# Altium project hardware-h3.PrjPcb
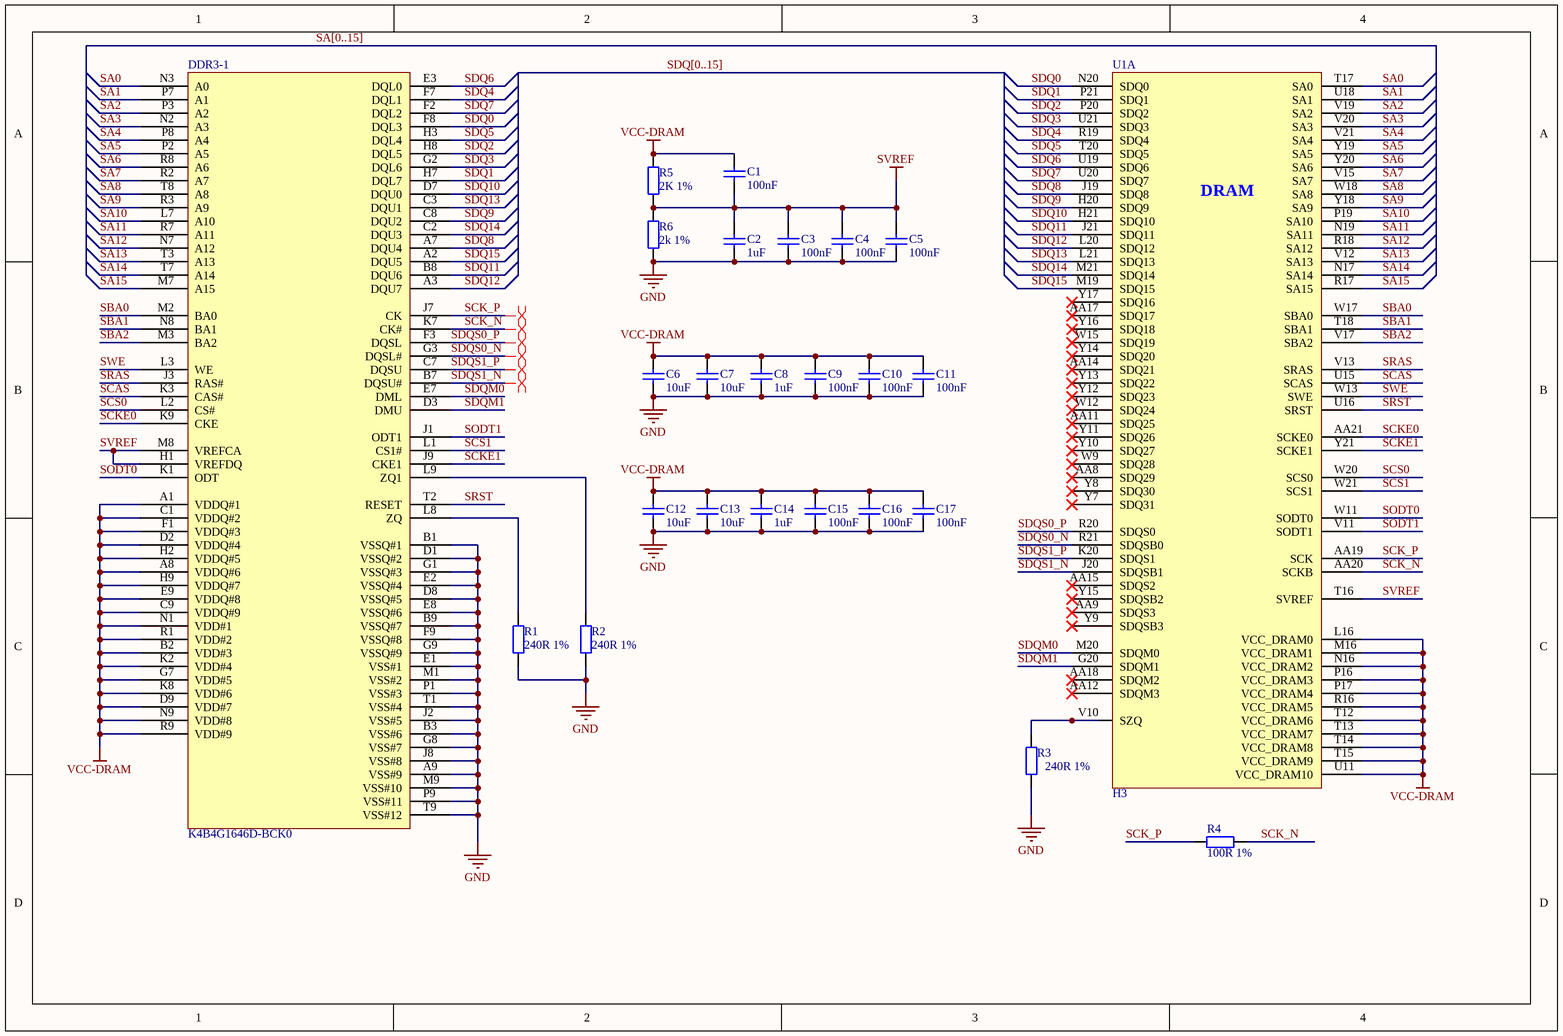
[diagram p0: ddr3.SchDoc]
9 sheets, 135 parts. Net scope: global (net labels, ports and power ports of the same name join across sheets).
Board file: gaga.PcbDoc
Sheets:
  gaga.SchDoc
  ddr3.SchDoc
  emmc.SchDoc
  gpiog-l.SchDoc
  io.SchDoc
  PHY-AUDIO-HDMI-TVout.SchDoc
  power.SchDoc
  screw.SchDoc
  usb-sys.SchDoc

## Sheet gaga.SchDoc
size A; SheetNumber: 1; SheetTotal: 1

## Sheet ddr3.SchDoc
size A4; SheetNumber: 1; SheetTotal: 7

### Parts
C1  100nF  [0402_C]
C2  1uF  [0402_C]
C3  100nF  [0402_C]
C4  100nF  [0402_C]
C5  100nF  [0402_C]
C6  10uF  [0402_C]
C7  10uF  [0402_C]
C8  1uF  [0402_C]
C9  100nF  [0402_C]
C10  100nF  [0402_C]
C11  100nF  [0402_C]
C12  10uF  [0402_C]
C13  10uF  [0402_C]
C14  1uF  [0402_C]
C15  100nF  [0402_C]
C16  100nF  [0402_C]
C17  100nF  [0402_C]
DDR3-1  K4B4G1646D-BCK0  [BGA96_DDR3]
R1  240R 1%  [0402_R]
R2  240R 1%  [0402_R]
R3  240R 1%  [0402_R]
R4  100R 1%  [0402_R]
R5  2K 1%  [0402_R]
R6  2k 1%  [0402_R]
U1  H3  [allwinner-h3]  (part A of 9)

### Nets
GND: C2.2 C3.2 C4.2 C5.2 C6.2 C7.2 C8.2 C9.2 C10.2 C11.2 C12.2 C13.2 C14.2 C15.2 C16.2 C17.2 DDR3-1.A9(VSS#9) DDR3-1.B1(VSSQ#1) DDR3-1.B3(VSS#6) DDR3-1.B9(VSSQ#7) DDR3-1.D1(VSSQ#2) DDR3-1.D8(VSSQ#5) DDR3-1.E1(VSS#1) DDR3-1.E2(VSSQ#4) DDR3-1.E8(VSSQ#6) DDR3-1.F9(VSSQ#8) DDR3-1.G1(VSSQ#3) DDR3-1.G8(VSS#7) DDR3-1.G9(VSSQ#9) DDR3-1.J2(VSS#5) DDR3-1.J8(VSS#8) DDR3-1.M1(VSS#2) DDR3-1.M9(VSS#10) DDR3-1.P1(VSS#3) DDR3-1.P9(VSS#11) DDR3-1.T1(VSS#4) DDR3-1.T9(VSS#12) R1.1 R2.1 R3.1 R6.2
SVREF: C1.2 C2.1 C3.1 C4.1 C5.1 DDR3-1.H1(VREFDQ) DDR3-1.M8(VREFCA) R5.1 R6.1 U1.T16(SVREF)
VCC-DRAM: C1.1 C6.1 C7.1 C8.1 C9.1 C10.1 C11.1 C12.1 C13.1 C14.1 C15.1 C16.1 C17.1 DDR3-1.A1(VDDQ#1) DDR3-1.A8(VDDQ#6) DDR3-1.B2(VDD#3) DDR3-1.C1(VDDQ#2) DDR3-1.C9(VDDQ#9) DDR3-1.D2(VDDQ#4) DDR3-1.D9(VDD#7) DDR3-1.E9(VDDQ#8) DDR3-1.F1(VDDQ#3) DDR3-1.G7(VDD#5) DDR3-1.H2(VDDQ#5) DDR3-1.H9(VDDQ#7) DDR3-1.K2(VDD#4) DDR3-1.K8(VDD#6) DDR3-1.N1(VDD#1) DDR3-1.N9(VDD#8) DDR3-1.R1(VDD#2) DDR3-1.R9(VDD#9) R5.2 U1.L16(VCC_DRAM0) U1.M16(VCC_DRAM1) U1.N16(VCC_DRAM2) U1.P16(VCC_DRAM3) U1.P17(VCC_DRAM4) U1.R16(VCC_DRAM5) U1.T12(VCC_DRAM6) U1.T13(VCC_DRAM7) U1.T14(VCC_DRAM8) U1.T15(VCC_DRAM9) U1.U11(VCC_DRAM10)
SA0: DDR3-1.N3(A0) U1.T17(SA0)
SA1: DDR3-1.P7(A1) U1.U18(SA1)
SA2: DDR3-1.P3(A2) U1.V19(SA2)
SA3: DDR3-1.N2(A3) U1.V20(SA3)
SA4: DDR3-1.P8(A4) U1.V21(SA4)
SA5: DDR3-1.P2(A5) U1.Y19(SA5)
SA6: DDR3-1.R8(A6) U1.Y20(SA6)
SA7: DDR3-1.R2(A7) U1.V15(SA7)
SA8: DDR3-1.T8(A8) U1.W18(SA8)
SA9: DDR3-1.R3(A9) U1.Y18(SA9)
SA10: DDR3-1.L7(A10) U1.P19(SA10)
SA11: DDR3-1.R7(A11) U1.N19(SA11)
SA12: DDR3-1.N7(A12) U1.R18(SA12)
SA13: DDR3-1.T3(A13) U1.V12(SA13)
SA14: DDR3-1.T7(A14) U1.N17(SA14)
SA15: DDR3-1.M7(A15) U1.R17(SA15)
SBA0: DDR3-1.M2(BA0) U1.W17(SBA0)
SBA1: DDR3-1.N8(BA1) U1.T18(SBA1)
SBA2: DDR3-1.M3(BA2) U1.V17(SBA2)
SCAS: DDR3-1.K3(CAS#) U1.U15(SCAS)
SCK_N: DDR3-1.K7(CK#) R4.2 U1.AA20(SCKB)
SCK_P: DDR3-1.J7(CK) R4.1 U1.AA19(SCK)
SCKE0: DDR3-1.K9(CKE) U1.AA21(SCKE0)
SCKE1: DDR3-1.J9(CKE1) U1.Y21(SCKE1)
SCS0: DDR3-1.L2(CS#) U1.W20(SCS0)
SCS1: DDR3-1.L1(CS1#) U1.W21(SCS1)
SDQ0: DDR3-1.F8(DQL3) U1.N20(SDQ0)
SDQ1: DDR3-1.H7(DQL7) U1.P21(SDQ1)
SDQ2: DDR3-1.H8(DQL5) U1.P20(SDQ2)
SDQ3: DDR3-1.G2(DQL6) U1.U21(SDQ3)
SDQ4: DDR3-1.F7(DQL1) U1.R19(SDQ4)
SDQ5: DDR3-1.H3(DQL4) U1.T20(SDQ5)
SDQ6: DDR3-1.E3(DQL0) U1.U19(SDQ6)
SDQ7: DDR3-1.F2(DQL2) U1.U20(SDQ7)
SDQ8: DDR3-1.A7(DQU4) U1.J19(SDQ8)
SDQ9: DDR3-1.C8(DQU2) U1.H20(SDQ9)
SDQ10: DDR3-1.D7(DQU0) U1.H21(SDQ10)
SDQ11: DDR3-1.B8(DQU6) U1.J21(SDQ11)
SDQ12: DDR3-1.A3(DQU7) U1.L20(SDQ12)
SDQ13: DDR3-1.C3(DQU1) U1.L21(SDQ13)
SDQ14: DDR3-1.C2(DQU3) U1.M21(SDQ14)
SDQ15: DDR3-1.A2(DQU5) U1.M19(SDQ15)
SDQM0: DDR3-1.E7(DML) U1.M20(SDQM0)
SDQM1: DDR3-1.D3(DMU) U1.G20(SDQM1)
SDQS0_N: DDR3-1.G3(DQSL#) U1.R21(SDQSB0)
SDQS0_P: DDR3-1.F3(DQSL) U1.R20(SDQS0)
SDQS1_N: DDR3-1.B7(DQSU#) U1.J20(SDQSB1)
SDQS1_P: DDR3-1.C7(DQSU) U1.K20(SDQS1)
SODT0: DDR3-1.K1(ODT) U1.W11(SODT0)
SODT1: DDR3-1.J1(ODT1) U1.V11(SODT1)
SRAS: DDR3-1.J3(RAS#) U1.V13(SRAS)
SRST: DDR3-1.T2(RESET) U1.U16(SRST)
SWE: DDR3-1.L3(WE) U1.W13(SWE)
NetDDR3-1_L8: DDR3-1.L8(ZQ) R1.2
NetDDR3-1_L9: DDR3-1.L9(ZQ1) R2.2
NetR3_2: R3.2 U1.V10(SZQ)

Not connected (* = marked no-connect by the designer): U1 AA8(SDQ29)* AA9(SDQS3)* AA11(SDQ25)* AA12(SDQM3)* AA14(SDQ21)* AA15(SDQS2)* AA17(SDQ17)* AA18(SDQM2)* W9(SDQ28)* W12(SDQ24)* W15(SDQ19)* Y7(SDQ31)* Y8(SDQ30)* Y9(SDQSB3)* Y10(SDQ27)* Y11(SDQ26)* Y12(SDQ23)* Y13(SDQ22)* Y14(SDQ20)* Y15(SDQSB2)* Y16(SDQ18)* Y17(SDQ16)*

### Buses and harness runs
bus SA[0..15]
bus SDQ[0..15]

### Layout directives
differential pair: SCK_N, SCK_P, SDQS0_N, SDQS0_P, SDQS1_N, SDQS1_P

### Notes on the sheet
- (in symbol H3_CPU, part A) DRAM

### Library data of the parts
C1-C17 = CAP-SMD: smd capacitor
DDR3-1 = DDR3-96pin: ddr3 96 BGA
R1-R6 = RES-SMD: smd resistor
U1 = H3_CPU: CPU

## Sheet emmc.SchDoc
size A4; SheetNumber: 2; SheetTotal: 5
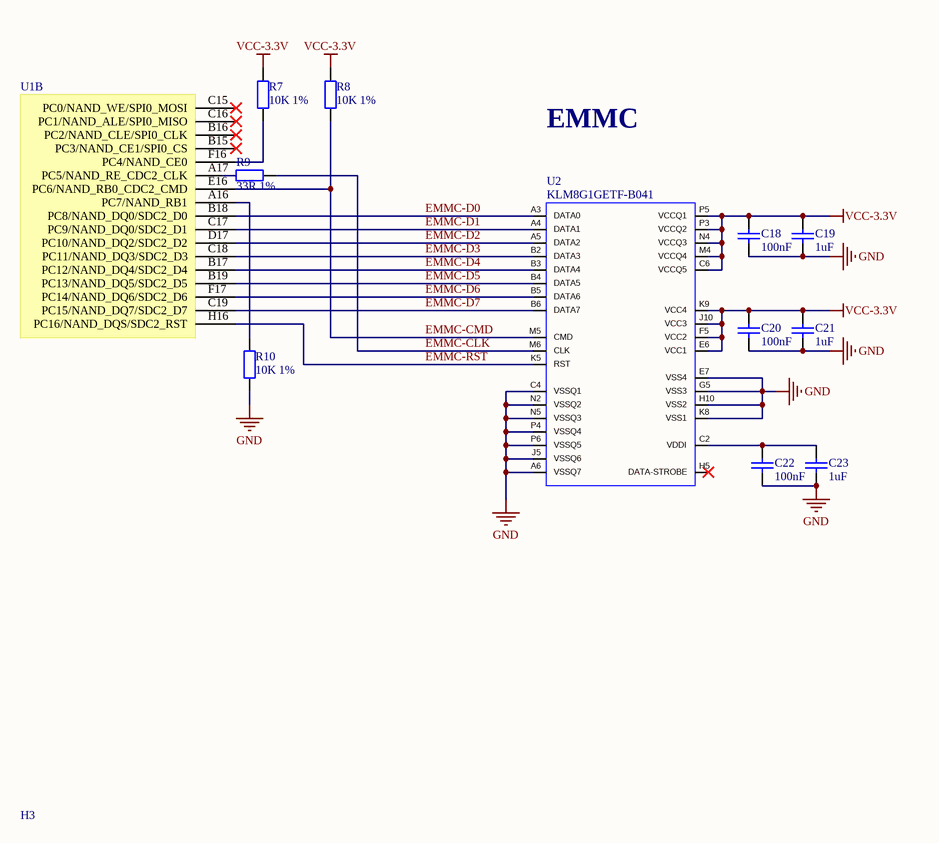
[diagram p1: emmc.SchDoc]

### Parts
C18  100nF  [0402_C]
C19  1uF  [0402_C]
C20  100nF  [0402_C]
C21  1uF  [0402_C]
C22  100nF  [0402_C]
C23  1uF  [0402_C]
R7  10K 1%  [0402_R]
R8  10K 1%  [0402_R]
R9  33R 1%  [0402_R]
R10  10K 1%  [0402_R]
U1  H3  [allwinner-h3]  (part B of 9)
U2  KLM8G1GETF-B041  [KLM8G1GETF-B041]

### Nets
GND: C18.2 C19.2 C20.2 C21.2 C22.2 C23.2 R10.2 U2.A6(VSSQ7) U2.C4(VSSQ1) U2.E7(VSS4) U2.G5(VSS3) U2.H10(VSS2) U2.J5(VSSQ6) U2.K8(VSS1) U2.N2(VSSQ2) U2.N5(VSSQ3) U2.P4(VSSQ4) U2.P6(VSSQ5)
VCC-3.3V: C18.1 C19.1 C20.1 C21.1 R7.1 R8.1 U2.C6(VCCQ5) U2.E6(VCC1) U2.F5(VCC2) U2.J10(VCC3) U2.K9(VCC4) U2.M4(VCCQ4) U2.N4(VCCQ3) U2.P3(VCCQ2) U2.P5(VCCQ1)
EMMC-CLK: R9.2 U2.M6(CLK)
EMMC-CMD: R8.2 U1.E16(PC6/NAND_RB0_CDC2_CMD) U2.M5(CMD)
EMMC-D0: U1.B18(PC8/NAND_DQ0/SDC2_D0) U2.A3(DATA0)
EMMC-D1: U1.C17(PC9/NAND_DQ0/SDC2_D1) U2.A4(DATA1)
EMMC-D2: U1.D17(PC10/NAND_DQ2/SDC2_D2) U2.A5(DATA2)
EMMC-D3: U1.C18(PC11/NAND_DQ3/SDC2_D3) U2.B2(DATA3)
EMMC-D4: U1.B17(PC12/NAND_DQ4/SDC2_D4) U2.B3(DATA4)
EMMC-D5: U1.B19(PC13/NAND_DQ5/SDC2_D5) U2.B4(DATA5)
EMMC-D6: U1.F17(PC14/NAND_DQ6/SDC2_D6) U2.B5(DATA6)
EMMC-D7: U1.C19(PC15/NAND_DQ7/SDC2_D7) U2.B6(DATA7)
EMMC-RST: U1.H16(PC16/NAND_DQS/SDC2_RST) U2.K5(RST)
NetC22_1: C22.1 C23.1 U2.C2(VDDI)
NetR7_2: R7.2 U1.F16(PC4/NAND_CE0)
NetR9_1: R9.1 U1.A17(PC5/NAND_RE_CDC2_CLK)
NetR10_1: R10.1 U1.A16(PC7/NAND_RB1)

Not connected (* = marked no-connect by the designer): U1 B15(PC3/NAND_CE1/SPI0_CS)* B16(PC2/NAND_CLE/SPI0_CLK)* C15(PC0/NAND_WE/SPI0_MOSI)* C16(PC1/NAND_ALE/SPI0_MISO)*; U2 H5(DATA-STROBE)*

### Notes on the sheet
- EMMC

### Library data of the parts
C18-C23 = CAP-SMD: smd capacitor
R7-R10 = RES-SMD: smd resistor
U1 = H3_CPU: CPU
U2 = KLM8G1GEND-B031: EMMC 8G

## Sheet gpiog-l.SchDoc
size A4; SheetNumber: 7; SheetTotal: 7
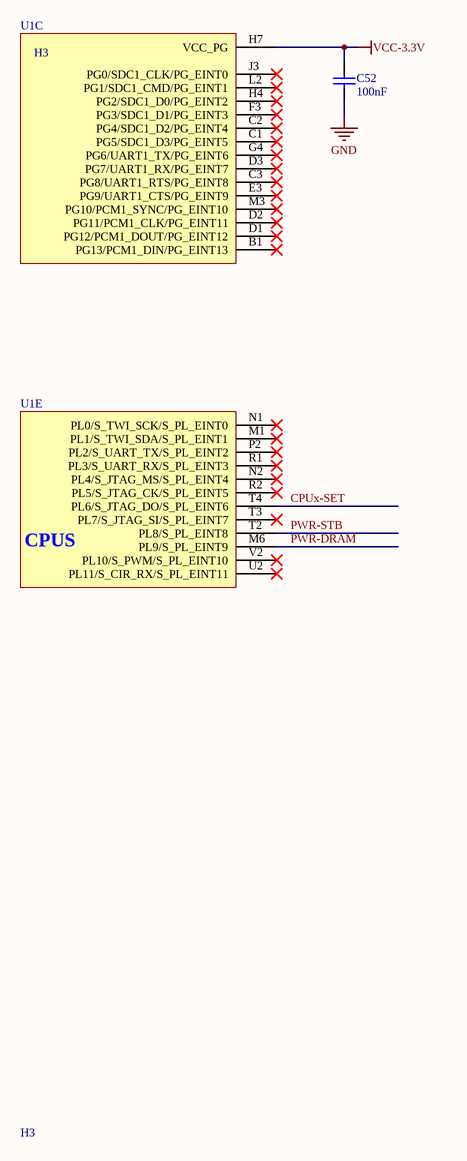
[diagram p2: gpiog-l.SchDoc]

### Parts
C52  100nF  [0402_C]
U1  H3  [allwinner-h3]  (parts C,E of 9)

### Nets
GND: C52.2
VCC-3.3V: C52.1 U1.H7(VCC_PG)
CPUx-SET: U1.T4(PL6/S_JTAG_DO/S_PL_EINT6)
PWR-DRAM: U1.M6(PL9/S_PL_EINT9)
PWR-STB: U1.T2(PL8/S_PL_EINT8)

Not connected (* = marked no-connect by the designer): U1 B1(PG13/PCM1_DIN/PG_EINT13)* C1(PG5/SDC1_D3/PG_EINT5)* C2(PG4/SDC1_D2/PG_EINT4)* C3(PG8/UART1_RTS/PG_EINT8)* D1(PG12/PCM1_DOUT/PG_EINT12)* D2(PG11/PCM1_CLK/PG_EINT11)* D3(PG7/UART1_RX/PG_EINT7)* E3(PG9/UART1_CTS/PG_EINT9)* F3(PG3/SDC1_D1/PG_EINT3)* G4(PG6/UART1_TX/PG_EINT6)* H4(PG2/SDC1_D0/PG_EINT2)* J3(PG0/SDC1_CLK/PG_EINT0)* L2(PG1/SDC1_CMD/PG_EINT1)* M1(PL1/S_TWI_SDA/S_PL_EINT1)* M3(PG10/PCM1_SYNC/PG_EINT10)* N1(PL0/S_TWI_SCK/S_PL_EINT0)* N2(PL4/S_JTAG_MS/S_PL_EINT4)* P2(PL2/S_UART_TX/S_PL_EINT2)* R1(PL3/S_UART_RX/S_PL_EINT3)* R2(PL5/S_JTAG_CK/S_PL_EINT5)* T3(PL7/S_JTAG_SI/S_PL_EINT7)* U2(PL11/S_CIR_RX/S_PL_EINT11)* V2(PL10/S_PWM/S_PL_EINT10)*

### Notes on the sheet
- (in symbol H3_CPU, part E) CPUS

### Library data of the parts
C52 = CAP-SMD: smd capacitor
U1 = H3_CPU: CPU

## Sheet io.SchDoc
size A4; SheetNumber: 3; SheetTotal: 8
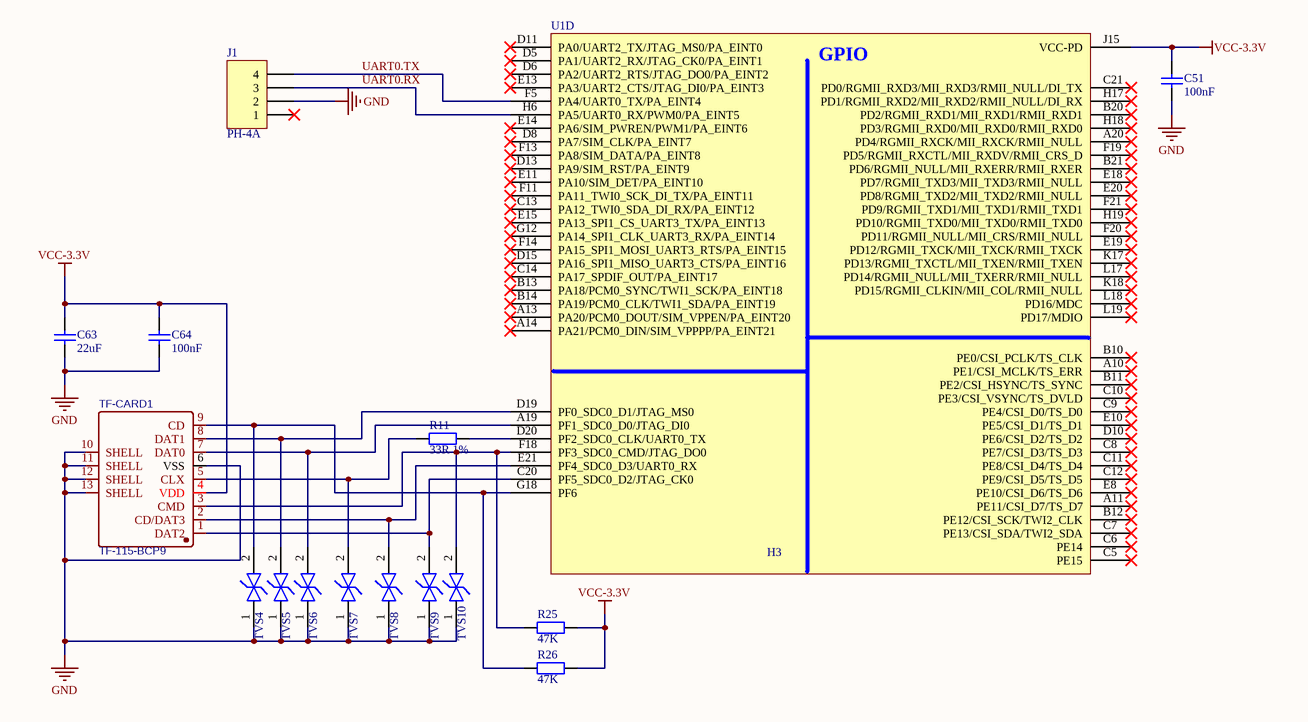
[diagram p3: io.SchDoc]

### Parts
C51  100nF  [0402_C]
C63  22uF  [0603_C]
C64  100nF  [0402_C]
J1  PH-4A  [CONN-TH_PH-4A]
R11  33R 1%  [0402_R]
R25  47K  [0402_R]
R26  47K  [0402_R]
TF-CARD1  TF-115-BCP9  [TF-115-BCP9]
TVS4  BSD5C051L  [SOD-523_TVS]  (value not drawn)
TVS5  BSD5C051L  [SOD-523_TVS]  (value not drawn)
TVS6  BSD5C051L  [SOD-523_TVS]  (value not drawn)
TVS7  BSD5C051L  [SOD-523_TVS]  (value not drawn)
TVS8  BSD5C051L  [SOD-523_TVS]  (value not drawn)
TVS9  BSD5C051L  [SOD-523_TVS]  (value not drawn)
TVS10  BSD5C051L  [SOD-523_TVS]  (value not drawn)
U1  H3  [allwinner-h3]  (part D of 9)

### Nets
GND: C51.2 C63.2 C64.2 J1.2 TF-CARD1.6(VSS) TF-CARD1.10(SHELL) TF-CARD1.11(SHELL) TF-CARD1.12(SHELL) TF-CARD1.13(SHELL) TVS4.1 TVS5.1 TVS6.1 TVS7.1 TVS8.1 TVS9.1 TVS10.1
VCC-3.3V: C51.1 C63.1 C64.1 R25.2 R26.2 TF-CARD1.4(VDD) U1.J15(VCC-PD)
UART0.RX: J1.3 U1.H6(PA5/UART0_RX/PWM0/PA_EINT5)
UART0.TX: J1.4 U1.F5(PA4/UART0_TX/PA_EINT4)
NetR11_1: R11.1 TF-CARD1.5(CLX) TVS7.2
NetR11_2: R11.2 U1.D20(PF2_SDC0_CLK/UART0_TX)
NetR25_1: R25.1 TF-CARD1.3(CMD) TVS10.2 U1.F18(PF3_SDC0_CMD/JTAG_DO0)
NetR26_1: R26.1 TF-CARD1.9(CD) TVS4.2 U1.G18(PF6)
NetTF-CARD1_1: TF-CARD1.1(DAT2) TVS9.2 U1.C20(PF5_SDC0_D2/JTAG_CK0)
NetTF-CARD1_2: TF-CARD1.2(CD/DAT3) TVS8.2 U1.E21(PF4_SDC0_D3/UART0_RX)
NetTF-CARD1_7: TF-CARD1.7(DAT0) TVS6.2 U1.A19(PF1_SDC0_D0/JTAG_DI0)
NetTF-CARD1_8: TF-CARD1.8(DAT1) TVS5.2 U1.D19(PF0_SDC0_D1/JTAG_MS0)

Not connected (* = marked no-connect by the designer): J1 1*; U1 A10(PE1/CSI_MCLK/TS_ERR)* A11(PE11/CSI_D7/TS_D7)* A13(PA20/PCM0_DOUT/SIM_VPPEN/PA_EINT20)* A14(PA21/PCM0_DIN/SIM_VPPPP/PA_EINT21)* A20(PD4/RGMII_RXCK/MII_RXCK/RMII_NULL)* B10(PE0/CSI_PCLK/TS_CLK)* B11(PE2/CSI_HSYNC/TS_SYNC)* B12(PE12/CSI_SCK/TWI2_CLK)* B13(PA18/PCM0_SYNC/TWI1_SCK/PA_EINT18)* B14(PA19/PCM0_CLK/TWI1_SDA/PA_EINT19)* B20(PD2/RGMII_RXD1/MII_RXD1/RMII_RXD1)* B21(PD6/RGMII_NULL/MII_RXERR/RMII_RXER)* C5(PE15)* C6(PE14)* C7(PE13/CSI_SDA/TWI2_SDA)* C8(PE7/CSI_D3/TS_D3)* C9(PE4/CSI_D0/TS_D0)* C10(PE3/CSI_VSYNC/TS_DVLD)* C11(PE8/CSI_D4/TS_D4)* C12(PE9/CSI_D5/TS_D5)* C13(PA12_TWI0_SDA_DI_RX/PA_EINT12)* C14(PA17_SPDIF_OUT/PA_EINT17)* C21(PD0/RGMII_RXD3/MII_RXD3/RMII_NULL/DI_TX)* D5(PA1/UART2_RX/JTAG_CK0/PA_EINT1)* D6(PA2/UART2_RTS/JTAG_DO0/PA_EINT2)* D8(PA7/SIM_CLK/PA_EINT7)* D10(PE6/CSI_D2/TS_D2)* D11(PA0/UART2_TX/JTAG_MS0/PA_EINT0)* D13(PA9/SIM_RST/PA_EINT9)* D15(PA16_SPI1_MISO_UART3_CTS/PA_EINT16)* E8(PE10/CSI_D6/TS_D6)* E10(PE5/CSI_D1/TS_D1)* E11(PA10/SIM_DET/PA_EINT10)* E13(PA3/UART2_CTS/JTAG_DI0/PA_EINT3)* E14(PA6/SIM_PWREN/PWM1/PA_EINT6)* E15(PA13_SPI1_CS_UART3_TX/PA_EINT13)* E18(PD7/RGMII_TXD3/MII_TXD3/RMII_NULL)* E19(PD12/RGMII_TXCK/MII_TXCK/RMII_TXCK)* E20(PD8/RGMII_TXD2/MII_TXD2/RMII_NULL)* F11(PA11_TWI0_SCK_DI_TX/PA_EINT11)* F13(PA8/SIM_DATA/PA_EINT8)* F14(PA15_SPI1_MOSI_UART3_RTS/PA_EINT15)* F19(PD5/RGMII_RXCTL/MII_RXDV/RMII_CRS_D)* F20(PD11/RGMII_NULL/MII_CRS/RMII_NULL)* F21(PD9/RGMII_TXD1/MII_TXD1/RMII_TXD1)* G12(PA14_SPI1_CLK_UART3_RX/PA_EINT14)* H17(PD1/RGMII_RXD2/MII_RXD2/RMII_NULL/DI_RX)* H18(PD3/RGMII_RXD0/MII_RXD0/RMII_RXD0)* H19(PD10/RGMII_TXD0/MII_TXD0/RMII_TXD0)* K17(PD13/RGMII_TXCTL/MII_TXEN/RMII_TXEN)* K18(PD15/RGMII_CLKIN/MII_COL/RMII_NULL)* L17(PD14/RGMII_NULL/MII_TXERR/RMII_NULL)* L18(PD16/MDC)* L19(PD17/MDIO)*

### Notes on the sheet
- (in symbol H3_CPU, part D) GPIO

### Library data of the parts
C51 C63 C64 = CAP-SMD: smd capacitor
J1 = Header-4pin: Header, 4-Pin
R11 R25 R26 = RES-SMD: smd resistor
TF-CARD1 = TF-CARD: TF card
TVS4-TVS10 = TVS-DIODE-SMD: Transient Voltage Suppressor
U1 = H3_CPU: CPU

## Sheet PHY-AUDIO-HDMI-TVout.SchDoc
size A4; SheetNumber: 5; SheetTotal: 8
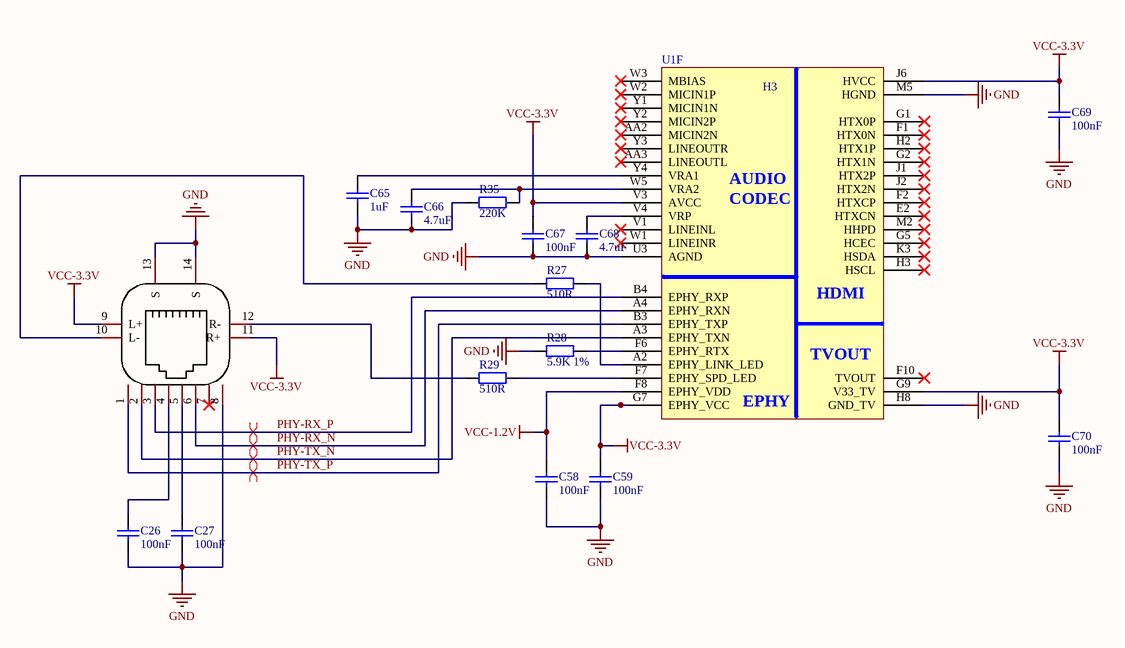
[diagram p4: PHY-AUDIO-HDMI-TVout.SchDoc]

### Parts
C26  100nF  [0402_C]
C27  100nF  [0402_C]
C58  100nF  [0402_C]
C59  100nF  [0402_C]
C65  1uF  [0402_C]
C66  4.7uF  [0402_C]
C67  100nF  [0402_C]
C68  4.7uF  [0402_C]
C69  100nF  [0402_C]
C70  100nF  [0402_C]
R27  510R  [0402_R]
R28  5.9K 1%  [0402_R]
R29  510R  [0402_R]
R35  220K  [0402_R]
RJ1  R-RJ45R08P-C000  [R-RJ45R08P-C000]  (value not drawn)
U1  H3  [allwinner-h3]  (part F of 9)

### Nets
GND: C26.2 C27.2 C58.2 C59.2 C65.2 C66.2 C67.2 C68.2 C69.2 C70.2 R28.1 R35.1 RJ1.8 RJ1.13(S) RJ1.14(S) U1.H8(GND_TV) U1.M5(HGND) U1.U3(AGND)
VCC-1.2V: C58.1 U1.F8(EPHY_VDD)
VCC-3.3V: C59.1 C67.1 C69.1 C70.1 RJ1.9(L+) RJ1.11(R+) U1.G7(EPHY_VCC) U1.G9(V33_TV) U1.J6(HVCC) U1.V3(AVCC)
PHY-RX_N: RJ1.6 U1.A4(EPHY_RXN)
PHY-RX_P: RJ1.3 U1.B4(EPHY_RXP)
PHY-TX_N: RJ1.2 U1.A3(EPHY_TXN)
PHY-TX_P: RJ1.1 U1.B3(EPHY_TXP)
NetC26_1: C26.1 RJ1.4
NetC27_1: C27.1 RJ1.5
NetC65_1: C65.1 U1.Y4(VRA1)
NetC66_1: C66.1 R35.2 U1.W5(VRA2)
NetC68_1: C68.1 U1.V4(VRP)
NetR27_1: R27.1 RJ1.10(L-)
NetR27_2: R27.2 U1.A2(EPHY_LINK_LED)
NetR28_2: R28.2 U1.F6(EPHY_RTX)
NetR29_1: R29.1 RJ1.12(R-)
NetR29_2: R29.2 U1.F7(EPHY_SPD_LED)

Not connected (* = marked no-connect by the designer): RJ1 7*; U1 AA2(MICIN2N)* AA3(LINEOUTL)* E2(HTXCN)* F1(HTX0N)* F2(HTXCP)* F10(TVOUT)* G1(HTX0P)* G2(HTX1N)* G5(HCEC)* H2(HTX1P)* H3(HSCL)* J1(HTX2P)* J2(HTX2N)* K3(HSDA)* M2(HHPD)* V1(LINEINL)* W1(LINEINR)* W2(MICIN1P)* W3(MBIAS)* Y1(MICIN1N)* Y2(MICIN2P)* Y3(LINEOUTR)*

### Layout directives
differential pair: PHY-RX_N, PHY-RX_P, PHY-TX_N, PHY-TX_P

### Notes on the sheet
- (in symbol H3_CPU, part F) AUDIO; CODEC; HDMI; EPHY

### Library data of the parts
C26 C27 C58 C59 C65-C70 = CAP-SMD: smd capacitor
R27-R29 R35 = RES-SMD: smd resistor
RJ1 = R-RJ45R08P-C000: RJ45
U1 = H3_CPU: CPU

## Sheet power.SchDoc
size A4; SheetNumber: 7; SheetTotal: 9
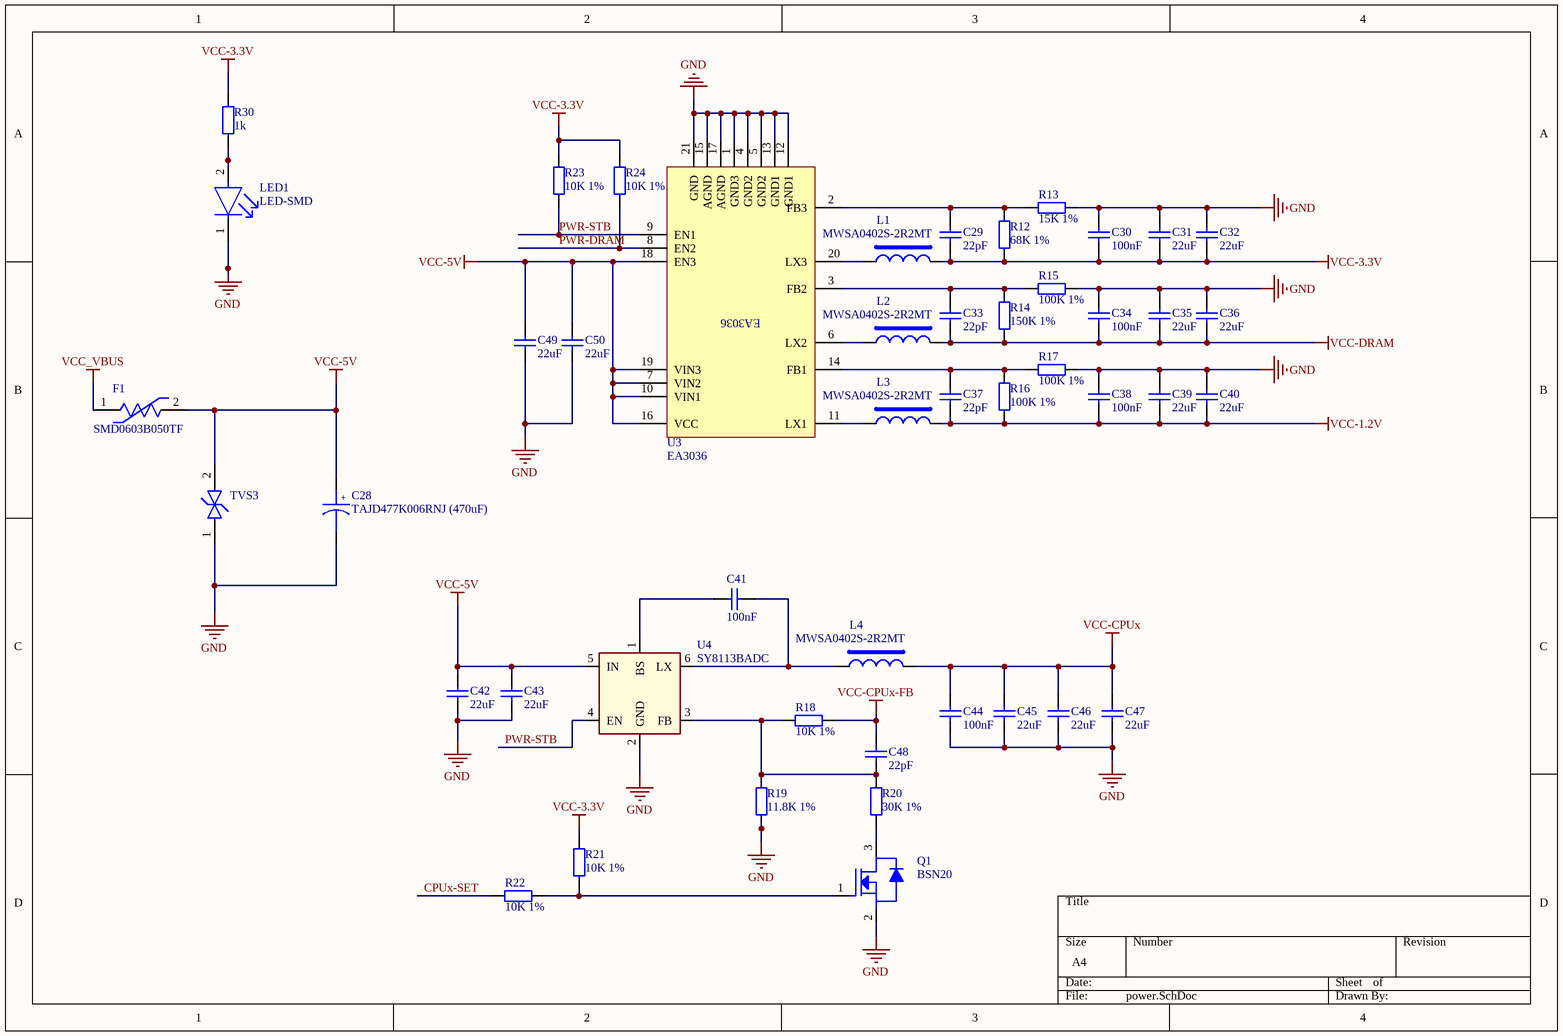
[diagram p5: power.SchDoc]

### Parts
C28  TAJD477K006RNJ (470uF)  [7343_C_POL]
C29  22pF  [0402_C]
C30  100nF  [0402_C]
C31  22uF  [0603_C]
C32  22uF  [0603_C]
C33  22pF  [0402_C]
C34  100nF  [0402_C]
C35  22uF  [0603_C]
C36  22uF  [0603_C]
C37  22pF  [0402_C]
C38  100nF  [0402_C]
C39  22uF  [0603_C]
C40  22uF  [0603_C]
C41  100nF  [0402_C]
C42  22uF  [0603_C]
C43  22uF  [0603_C]
C44  100nF  [0402_C]
C45  22uF  [0603_C]
C46  22uF  [0603_C]
C47  22uF  [0603_C]
C48  22pF  [0402_C]
C49  22uF  [0603_C]
C50  22uF  [0603_C]
F1  SMD0603B050TF  [0603_FUSE]
L1  MWSA0402S-2R2MT  [0402S_L]
L2  MWSA0402S-2R2MT  [0402S_L]
L3  MWSA0402S-2R2MT  [0402S_L]
L4  MWSA0402S-2R2MT  [0402S_L]
LED1  LED-SMD  [0603_LED_BLUE]
Q1  BSN20  [SOT-23]
R12  68K 1%  [0402_R]
R13  15K 1%  [0402_R]
R14  150K 1%  [0402_R]
R15  100K 1%  [0402_R]
R16  100K 1%  [0402_R]
R17  100K 1%  [0402_R]
R18  10K 1%  [0402_R]
R19  11.8K 1%  [0402_R]
R20  30K 1%  [0402_R]
R21  10K 1%  [0402_R]
R22  10K 1%  [0402_R]
R23  10K 1%  [0402_R]
R24  10K 1%  [0402_R]
R30  1k  [0402_R]
TVS3  BSD5C051L  [SOD-523_TVS]  (value not drawn)
U3  EA3036  [QFN3x3-20]
U4  SY8113BADC  [SOT23-6]

### Nets
GND: C28.2 C30.1 C31.1 C32.1 C34.1 C35.1 C36.1 C38.1 C39.1 C40.1 C42.2 C43.2 C44.2 C45.2 C46.2 C47.2 C49.2 C50.2 LED1.1(-) Q1.2(SOURCE) R13.1 R15.1 R17.1 R19.1 TVS3.1 U3.1(GND3) U3.4(GND2) U3.5(GND2) U3.12(GND1) U3.13(GND1) U3.15(AGND) U3.17(AGND) U3.21(GND) U4.2(GND)
VCC-1.2V: C37.2 C38.2 C39.2 C40.2 L3.2 R16.1
VCC-3.3V: C29.2 C30.2 C31.2 C32.2 L1.2 R12.1 R21.2 R23.2 R24.2 R30.2
VCC-5V: C28.1 C42.1 C43.1 C49.1 C50.1 F1.2 TVS3.2 U3.7(VIN2) U3.10(VIN1) U3.16(VCC) U3.18(EN3) U3.19(VIN3) U4.5(IN)
VCC-CPUx: C44.1 C45.1 C46.1 C47.1 L4.2
VCC-CPUx-FB: C48.1 R18.2
VCC-DRAM: C33.2 C34.2 C35.2 C36.2 L2.2 R14.1
VCC_VBUS: F1.1
CPUx-SET: R22.2
PWR-DRAM: R24.1 U3.8(EN2)
PWR-STB: R23.1 U3.9(EN1) U4.4(EN)
NetC29_1: C29.1 R12.2 R13.2 U3.2(FB3)
NetC33_1: C33.1 R14.2 R15.2 U3.3(FB2)
NetC37_1: C37.1 R16.2 R17.2 U3.14(FB1)
NetC41_1: C41.1 U4.1(BS)
NetC41_2: C41.2 L4.1 U4.6(LX)
NetC48_2: C48.2 R18.1 R19.2 R20.2 U4.3(FB)
NetL1_1: L1.1 U3.20(LX3)
NetL2_1: L2.1 U3.6(LX2)
NetL3_1: L3.1 U3.11(LX1)
NetLED1_2: LED1.2(+) R30.1
NetQ1_1: Q1.1(GATE) R21.1 R22.1
NetQ1_3: Q1.3(DRAIN) R20.1

### Notes on the sheet
- (in symbol CAP-POL-SMD) +

### Library data of the parts
C28 = CAP-POL-SMD: smd pol capacitor
C29-C50 = CAP-SMD: smd capacitor
F1 = FUSE-SMD: RESET FUSE
L1-L4 = IND-SMD: inductor
LED1 = LED-SMD: 0603 LED SMD
Q1 = NMOS
R12-R24 R30 = RES-SMD: smd resistor
TVS3 = TVS-DIODE-SMD: Transient Voltage Suppressor
U3 = EA3036: DC-DC
U4 = SY8113BADC: DC-DC

## Sheet screw.SchDoc
size A4; SheetNumber: 8; SheetTotal: 8
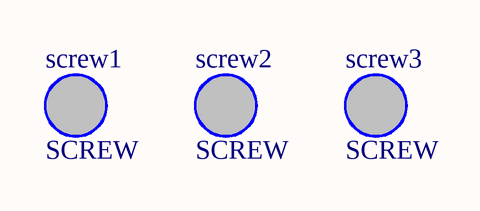
[diagram p6: screw.SchDoc]

### Parts
screw1  SCREW  [SCREW]
screw2  SCREW  [SCREW]
screw3  SCREW  [SCREW]

## Sheet usb-sys.SchDoc
size A4; SheetNumber: 4; SheetTotal: 8
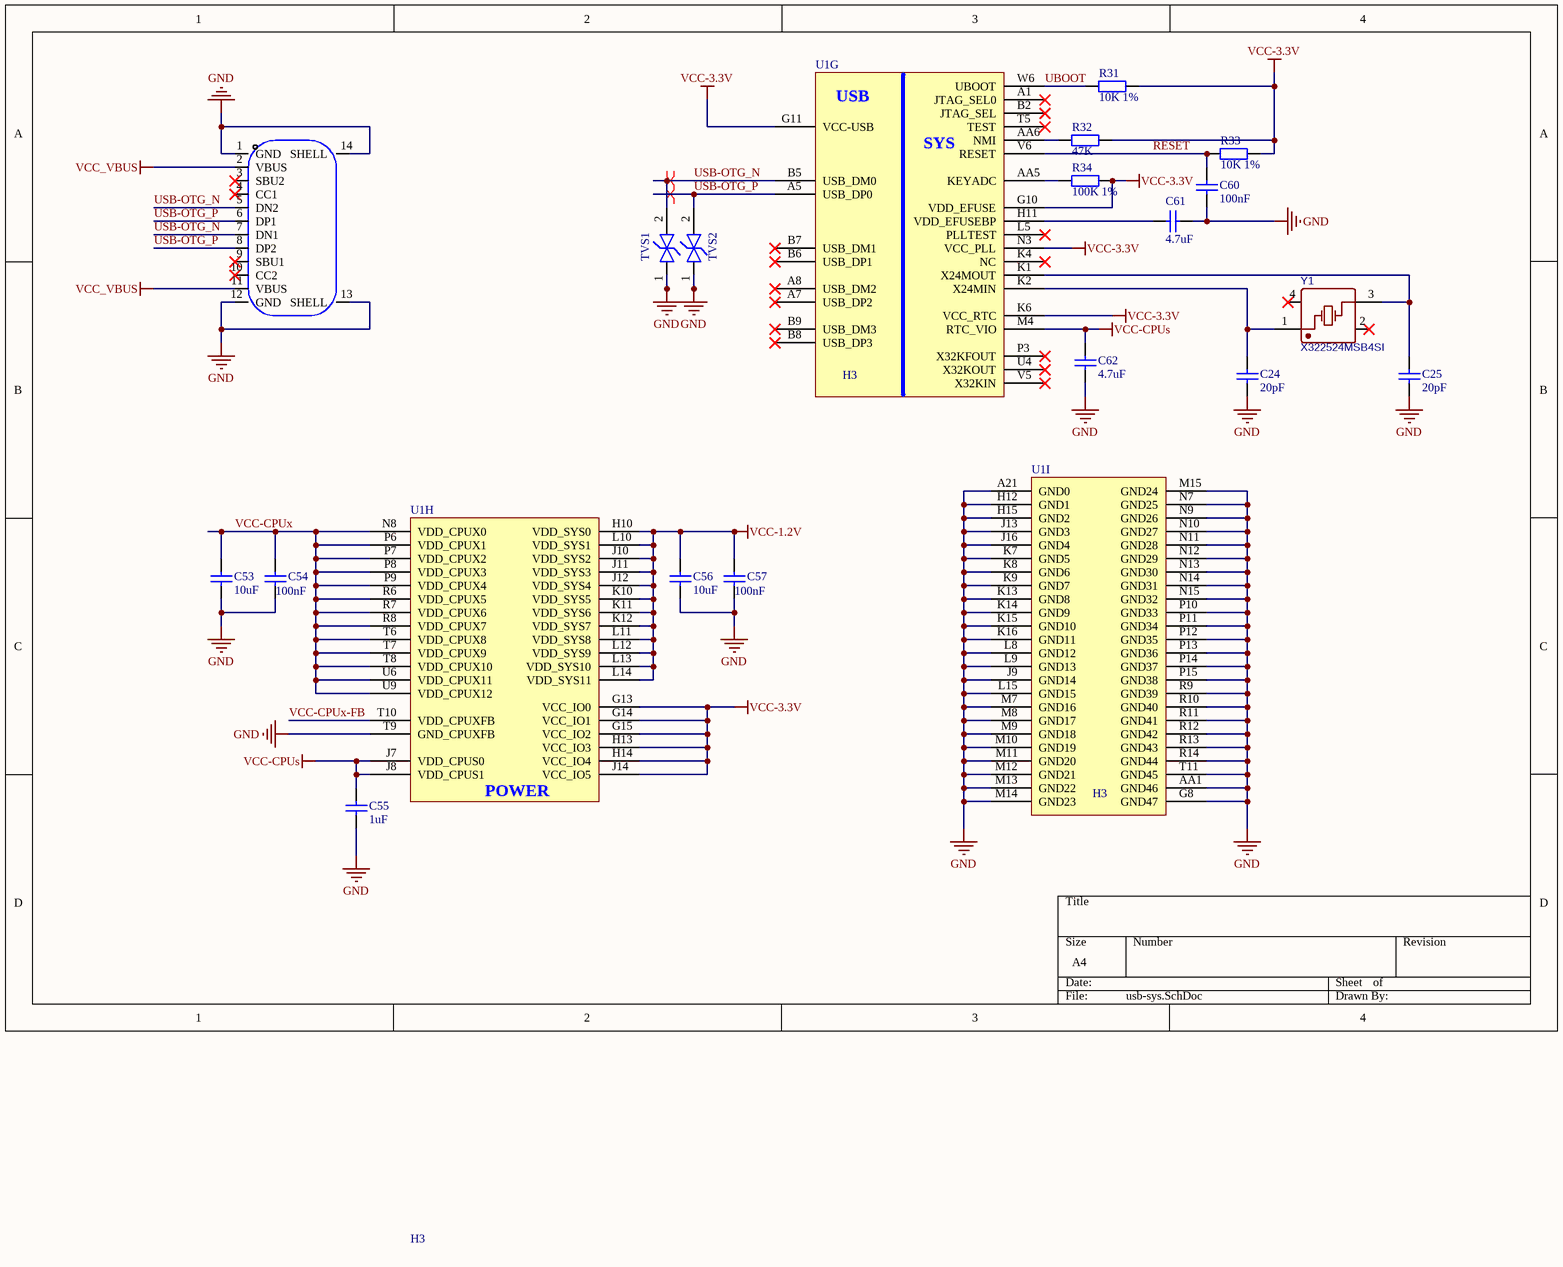
[diagram p7: usb-sys.SchDoc]

### Parts
C24  20pF  [0402_C]
C25  20pF  [0402_C]
C53  10uF  [0402_C]
C54  100nF  [0402_C]
C55  1uF  [0402_C]
C56  10uF  [0402_C]
C57  100nF  [0402_C]
C60  100nF  [0402_C]
C61  4.7uF  [0402_C]
C62  4.7uF  [0402_C]
R31  10K 1%  [0402_R]
R32  47K  [0402_R]
R33  10K 1%  [0402_R]
R34  100K 1%  [0402_R]
TVS1  BSD5C051L  [SOD-523_TVS]  (value not drawn)
TVS2  BSD5C051L  [SOD-523_TVS]  (value not drawn)
typec-1  TYPE-C 16PIN 2MD(073)  [TYPE-C 16PIN 2MD(073)]  (value not drawn)
U1  H3  [allwinner-h3]  (parts G,H,I of 9)
Y1  X322524MSB4SI  [SMD3225-4P]

### Nets
GND: C24.2 C25.2 C53.2 C54.2 C55.2 C56.2 C57.2 C60.1 C61.2 C62.2 TVS1.1 TVS2.1 typec-1.1(GND) typec-1.12(GND) typec-1.13(SHELL) typec-1.14(SHELL) U1.A21(GND0) U1.AA1(GND46) U1.G8(GND47) U1.H12(GND1) U1.H15(GND2) U1.J9(GND14) U1.J13(GND3) U1.J16(GND4) U1.K7(GND5) U1.K8(GND6) U1.K9(GND7) U1.K13(GND8) U1.K14(GND9) U1.K15(GND10) U1.K16(GND11) U1.L8(GND12) U1.L9(GND13) U1.L15(GND15) U1.M7(GND16) U1.M8(GND17) U1.M9(GND18) U1.M10(GND19) U1.M11(GND20) U1.M12(GND21) U1.M13(GND22) U1.M14(GND23) U1.M15(GND24) U1.N7(GND25) U1.N9(GND26) U1.N10(GND27) U1.N11(GND28) U1.N12(GND29) U1.N13(GND30) U1.N14(GND31) U1.N15(GND32) U1.P10(GND33) U1.P11(GND34) U1.P12(GND35) U1.P13(GND36) U1.P14(GND37) U1.P15(GND38) U1.R9(GND39) U1.R10(GND40) U1.R11(GND41) U1.R12(GND42) U1.R13(GND43) U1.R14(GND44) U1.T9(GND_CPUXFB) U1.T11(GND45)
VCC-1.2V: C56.1 C57.1 U1.H10(VDD_SYS0) U1.J10(VDD_SYS2) U1.J11(VDD_SYS3) U1.J12(VDD_SYS4) U1.K10(VDD_SYS5) U1.K11(VDD_SYS6) U1.K12(VDD_SYS7) U1.L10(VDD_SYS1) U1.L11(VDD_SYS8) U1.L12(VDD_SYS9) U1.L13(VDD_SYS10) U1.L14(VDD_SYS11)
VCC-3.3V: R31.2 R32.2 R33.2 R34.2 U1.G10(VDD_EFUSE) U1.G11(VCC-USB) U1.G13(VCC_IO0) U1.G14(VCC_IO1) U1.G15(VCC_IO2) U1.H13(VCC_IO3) U1.H14(VCC_IO4) U1.J14(VCC_IO5) U1.K6(VCC_RTC) U1.N3(VCC_PLL)
VCC-CPUs: C55.1 C62.1 U1.J7(VDD_CPUS0) U1.J8(VDD_CPUS1) U1.M4(RTC_VIO)
VCC-CPUx: C53.1 C54.1 U1.N8(VDD_CPUX0) U1.P6(VDD_CPUX1) U1.P7(VDD_CPUX2) U1.P8(VDD_CPUX3) U1.P9(VDD_CPUX4) U1.R6(VDD_CPUX5) U1.R7(VDD_CPUX6) U1.R8(VDD_CPUX7) U1.T6(VDD_CPUX8) U1.T7(VDD_CPUX9) U1.T8(VDD_CPUX10) U1.U6(VDD_CPUX11) U1.U9(VDD_CPUX12)
VCC-CPUx-FB: U1.T10(VDD_CPUXFB)
VCC_VBUS: typec-1.2(VBUS) typec-1.11(VBUS)
RESET: C60.2 R33.1 U1.V6(RESET)
UBOOT: R31.1 U1.W6(UBOOT)
USB-OTG_N: TVS1.2 typec-1.5(DN2) typec-1.7(DN1) U1.B5(USB_DM0)
USB-OTG_P: TVS2.2 typec-1.6(DP1) typec-1.8(DP2) U1.A5(USB_DP0)
NetC24_1: C24.1 U1.K2(X24MIN) Y1.1(OE#)
NetC25_1: C25.1 U1.K1(X24MOUT) Y1.3(OUT)
NetC61_1: C61.1 U1.H11(VDD_EFUSEBP)
NetR32_1: R32.1 U1.AA6(NMI)
NetR34_1: R34.1 U1.AA5(KEYADC)

Not connected (* = marked no-connect by the designer): typec-1 3(SBU2)* 4(CC1)* 9(SBU1)* 10(CC2)*; U1 A1(JTAG_SEL0)* A7(USB_DP2)* A8(USB_DM2)* B2(JTAG_SEL)* B6(USB_DP1)* B7(USB_DM1)* B8(USB_DP3)* B9(USB_DM3)* K4(NC)* L5(PLLTEST)* P3(X32KFOUT)* T5(TEST)* U4(X32KOUT)* V5(X32KIN)*; Y1 2(GND)* 4(VDD)*

### Layout directives
differential pair: USB-OTG_N, USB-OTG_P

### Notes on the sheet
- (in symbol H3_CPU, part G) USB; SYS
- (in symbol H3_CPU, part H) POWER

### Library data of the parts
C24 C25 C53-C57 C60-C62 = CAP-SMD: smd capacitor
R31-R34 = RES-SMD: smd resistor
TVS1 TVS2 = TVS-DIODE-SMD: Transient Voltage Suppressor
typec-1 = TYPE-C-16PIN: type-c
U1 = H3_CPU: CPU
Y1 = XO-N-SOURCE-4pin: 24mHZ ,20pf , no source smd crystal oscillator

## Nets that join several sheets
GND: ddr3 (41 pins), emmc (18 pins), gpiog-l (C52.2), io (16 pins), PHY-AUDIO-HDMI-TVout (18 pins), power (34 pins), usb-sys (65 pins)
VCC-1.2V: PHY-AUDIO-HDMI-TVout (C58.1 U1.F8), power (6 pins), usb-sys (14 pins)
VCC-3.3V: emmc (15 pins), gpiog-l (C52.1 U1.H7), io (7 pins), PHY-AUDIO-HDMI-TVout (10 pins), power (10 pins), usb-sys (14 pins)
VCC-CPUx: power (5 pins), usb-sys (15 pins)
VCC-CPUx-FB: power (C48.1 R18.2), usb-sys (U1.T10)
VCC-DRAM: ddr3 (43 pins), power (6 pins)
VCC_VBUS: power (F1.1), usb-sys (typec-1.2 typec-1.11)
CPUx-SET: gpiog-l (U1.T4), power (R22.2)
PWR-DRAM: gpiog-l (U1.M6), power (R24.1 U3.8)
PWR-STB: gpiog-l (U1.T2), power (R23.1 U3.9 U4.4)